# Altium project Smartfin TSoM.PrjPcb
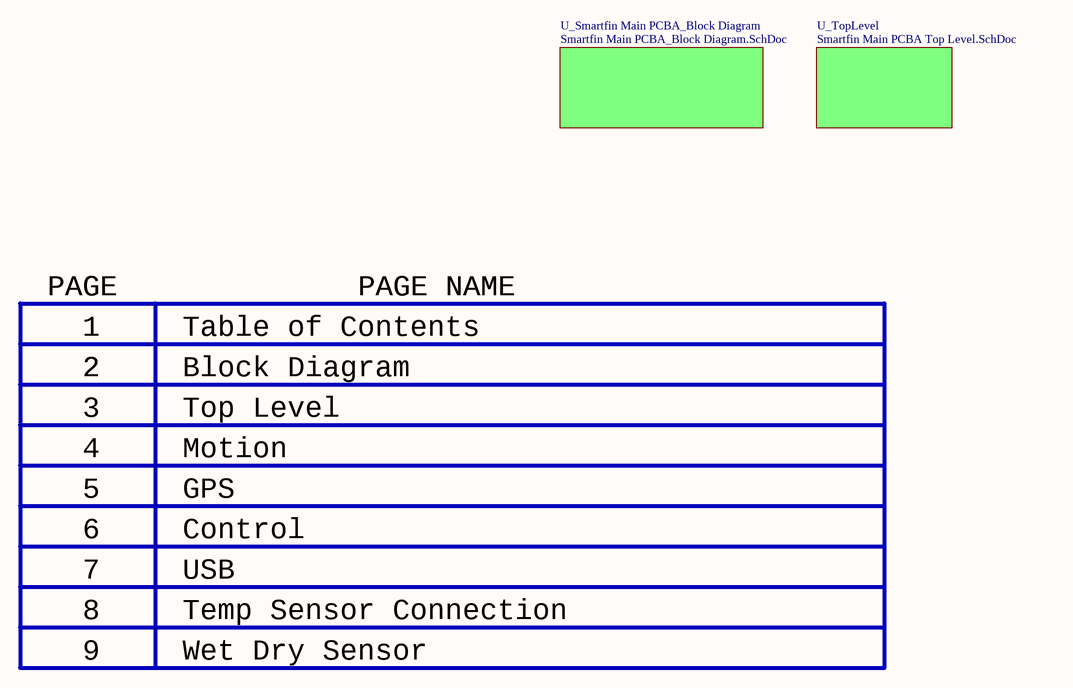
[diagram p0: Smartfin Main PCBA_TOC.SchDoc]
SOLDERMASK_USE_LPI: FALSE; SOLDERMASK_COLOR: BLUE; SCH_DOCNUM: 644-001-023; SCH_CURRENT_REV: C; PROJECT_NUM: 644-001; PROJECT_NAME: Smartfin; OVERLAY_USE_LPI: FALSE; OVERLAY_COLOR: WHITE; FAB_THIEVING_SPACE: 0.100"; FAB_THICKNESS: 0.032; FAB_SURFACE_FINISH: ENIG; FAB_STANDARD_RG_VALUE: 1; FAB_STACKUP_CB_VALUE: 0; FAB_STACKUP: USE FABRICATOR'S STANDARD LAYER STACK; FAB_SOLDER_SLIVERS: 0.004"; FAB_SOLDERMASK_COLOR: BLUE; FAB_ROHS: SHALL BE ROHS COMPLIANT; FAB_OVERLAY_COLOR: WHITE; FAB_MIN_ANNULAR_RING: 0.005"; FAB_MATERIAL_RG_VALUE: 3; FAB_MATERIAL: FR370-HR; FAB_LAYER_REGISTRATION: 0.005"; FAB_LAYERS: 4; FAB_IPC_STD: IPC-6012; FAB_INSPECT_CLASS: 2; FAB_HOLE_LOCATION: 0.008"; FAB_FINISH_RG_VALUE: 0; FAB_FINISHED_CU_WEIGHT: 1.5; FAB_FAB_CLASS: 2; FAB_ECO_REV3: C; FAB_ECO_REV2: B; FAB_ECO_REV1: A; FAB_ECO_NUM_CURRENT: 13237; FAB_ECO_NUM3: 13237; FAB_ECO_NUM2: 13065; FAB_ECO_NUM1: 12932; FAB_ECO_DESC3: UPDATED SS IN GPS AREA. MODIFED INTERNAL GND POURS IN GPS AREA. SEE ECO FOR DETAILS.; FAB_ECO_DESC2: MISCELLANEOUS UPDATES. SEE ECO FOR DETAILS.; FAB_ECO_DESC1: INITIAL RELEASE; FAB_ECO_DATE3: 8/17/2020; FAB_ECO_DATE2: 2/10/2020; FAB_ECO_DATE1: 10/24/2019; FAB_DRILL_TOLERANCE: 0.003"; FAB_DIMENSIONS_RG_VALUE: 0; FAB_DIMENSIONS: INCHES; FAB_CURRENT_REV: C; FAB_ACCEPT_RG_VALUE: 1; FABNOTE_THICKNESS: 0.032; FABNOTE_LAYERS: 4; FABNOTE_CUSTOMSTACK: FALSE; FABNOTE_12: 12. FINISHED PCB SHALL BE ROHS COMPLIANT.; FABNOTE_11: 11. SURFACE FINISH ON ALL EXPOSED COPPER SHALL BE ENIG.; FABNOTE_10: 10. OVERLAY ON BOTH SIDES, COLOR IS WHITE, UL-94V0 MARK REQUIRED.; FABNOTE_9: 9.  SOLDER MASK BOTH SIDES PER IPC-SM-840, COLOR IS BLUE.; FABNOTE_6: 6.  PCB IS 4 LAYERS, THICKNESS IS 0.032", USE FABRICATOR'S STANDARD LAYER STACK.; FABNOTE_5: 5.  PCB MATERIAL IS EPOXY FIBERGLASS FR370-HR.; FABNOTE_2B: INSPECT PER IPC-A-600, CLASS 2.; FABNOTE_2A: 2.  FABRICATE PCB PER IPC-6011 AND IPC-6012A, CLASS 2.; FABNOTE_1: 1.  DIMENSIONS ARE IN INCHES.; FABDWG_DOCNUM: 644-001-024; CONTACT_PHONE: 858-534-9306; CONTACT_NAME: Nathan Hui; CONTACT_EMAIL: e4e@ucsd.edu; BOM_DOCNUM: 644-001-031; BASELINE_ECO_REV3: C; BASELINE_ECO_REV2: B; BASELINE_ECO_REV1: A; BASELINE_ECO_NUM_CURRENT: 13237; BASELINE_ECO_NUM3: 13237; BASELINE_ECO_NUM2: 13065; BASELINE_ECO_NUM1: 12932; BASELINE_ECO_DATE3: 8/17/2020; BASELINE_ECO_DATE2: 2/10/2020; BASELINE_ECO_DATE1: 10/24/2019; BASELINE_DOCNUM: 644-001-033; BASELINE_CURRENT_REV: C; ASY_XYRS_FILE_NAME: 644-001-032 ASY REV C XYRS ECO13237.TXT; ASY_Wash_CB_Value: 0; ASY_WASH: NOT PERMITTED; ASY_RoHS_CB_Value: True; ASY_ROHS: ROHS COMPLIANT LEAD-FREE SOLDER PROCESS REQUIRED; ASY_NAME: Smartfin Main PCBA; ASY_Moisture_Sensitive_CB_Value: 1; ASY_ECO_REV3: C; ASY_ECO_REV2: B; ASY_ECO_REV1: A; ASY_ECO_NUM_CURRENT: 13237; ASY_ECO_NUM3: 13237; ASY_ECO_NUM2: 13065; ASY_ECO_NUM1: 12932; ASY_ECO_DESC3: UPDATED ASSY NOTES. UPDATED SS IN PCB. UPDATED BOM. SEE ECO FOR DETAILS.; ASY_ECO_DESC2: MISCELLANEOUS UPDATES. SEE ECO FOR DETAILS.; ASY_ECO_DESC1: INITIAL RELEASE; ASY_ECO_DATE3: 8/17/2020; ASY_ECO_DATE2: 2/10/2020; ASY_ECO_DATE1: 10/24/2019; ASY_CURRENT_REV: C; ASY_Confirmal_Coat_CB_Value: 0; ASY_CLASS: 2; ASY_BOM_FILE_NAME: 644-001-031 BOM REV C ECO13237.XLSX; ASY_Accept_RB_Value: 1; ASYNOTE_WASH: FALSE; ASYNOTE_ROHS: TRUE; ASYNOTE_MOISTURESENSITIVE: FALSE; ASYNOTE_11: 11. LABEL EACH ASSEMBLY WITH STANDARD IN HOUSE BUILD ID AND BOARD NUMBER.; ASYNOTE_10: 10. FINAL ASSEMBLY SHALL CONFORM TO IPC-A-610 CLASS 2.; ASYNOTE_9: 9.  DO NOT APPLY CONFORMAL COATING.; ASYNOTE_8: 8.  THIS DESIGN DOES INCLUDE MOISTURE SENSITIVE PARTS.; ASYNOTE_7: 7.  AQUEOUS WASH IS NOT PERMITTED.; ASYNOTE_5: 5.  LEAD-FREE SOLDER PROCESS REQUIRED (ROHS).; ASYNOTE_4: 4.  REFER TO "644-001-032 ASY REV C XYRS ECO13237.TXT" IN THIS ARCHIVE; ASYNOTE_2: 2.  REFER TO "644-001-031 BOM REV C ECO13237.XLSX" IN THIS ARCHIVE; ASYNOTE_1: 1.  DIMENSIONS ARE IN INCHES.; ASYDWG_MOISTURE_SENSITIVE: THIS DESIGN DOES NOT INCLUDE MOISTURE SENSITIVE PARTS; ASYDWG_DOCNUM: 644-001-032
8 sheets, 108 parts. Net scope: flat (ports and power ports of the same name join across sheets).
Board file: PCB1.PcbDoc
Sheets:
  Smartfin Main PCBA_TOC.SchDoc
    U_TopLevel = Smartfin Main PCBA Top Level.SchDoc
      U_Control = Smartfin Main PCBA Control.SchDoc
      U_Motion = Smartfin Main PCBA Motion.SchDoc
      U_Temp - Button = Smartfin Main PCBA Temp Sensor Connection.SchDoc
      U_USB = Smartfin Main PCBA USB.SchDoc
      U_Wet Dry Sensor = Smartfin Main PCBA Wet Dry Sensor.SchDoc
    U_Smartfin Main PCBA_Block Diagram = Smartfin Main PCBA_Block Diagram.SchDoc

## Sheet Smartfin Main PCBA_TOC.SchDoc: Table of Contents
size Letter; TOCFontName: Consolas; TOCFontSize: 24; TOCFontColor: 0; TOCFontAttributes: 0; TOCMaxLinesInTable: 25; TOCVerticalOffset: 200; TOCHorizontalOffset: 500; TOCHorizontalSeparation: 800; TOCVerticalSeparation: 30; TOCHorizTableSize: 640; Engineer: JOHN Q. ENGINEER; DocumentNumber: 000-000-000; Revision: A; SheetNumber: 1; SheetTotal: 8; PageSetup: Record=PageOptions|CenterHorizontal=True|CenterVertical=True|PrintScale=0.96|XCorrection=1.00|YCorrection=1.00|PrintKind=0|BorderSize=5000000|LeftOffset=0|BottomOffset=0|Orientation=2|PaperLength=1000|PaperWidth=1000|Scale=100|PaperSource=7|PrintQuality=-4|MediaType=1|DitherType=10|PaperKind=11" x 17"|PrintScaleMode=1

### Sub-sheets
U_Smartfin Main PCBA_Block Diagram = Smartfin Main PCBA_Block Diagram.SchDoc: no entries
U_TopLevel = Smartfin Main PCBA Top Level.SchDoc: no entries

### Notes on the sheet
- PAGE
- 1
- Table of Contents
- PAGE NAME
- 2
- Block Diagram
- 3
- 4
- Top Level
- Motion
- 5
- 6
- GPS
- Control
- 7
- USB
- 8
- 9
- Temp Sensor Connection
- Wet Dry Sensor

## Sheet Smartfin Main PCBA Top Level.SchDoc: Top Level
size Letter; TOCFontName: Consolas; TOCFontSize: 24; TOCFontColor: 0; TOCFontAttributes: 0; TOCMaxLinesInTable: 25; TOCVerticalOffset: 200; TOCHorizontalOffset: 500; TOCHorizontalSeparation: 800; TOCVerticalSeparation: 30; TOCHorizTableSize: 640; Engineer: Amy Domino; DocumentNumber: 644-001-023; Revision: A; SheetNumber: 3; SheetTotal: 9; PageSetup: Record=PageOptions|CenterHorizontal=True|CenterVertical=True|PrintScale=0.96|XCorrection=1.00|YCorrection=1.00|PrintKind=0|BorderSize=5000000|LeftOffset=0|BottomOffset=0|Orientation=2|PaperLength=1000|PaperWidth=1000|Scale=100|PaperSource=7|PrintQuality=-4|MediaType=1|DitherType=10|PaperKind=11" x 17"|PrintScaleMode=1
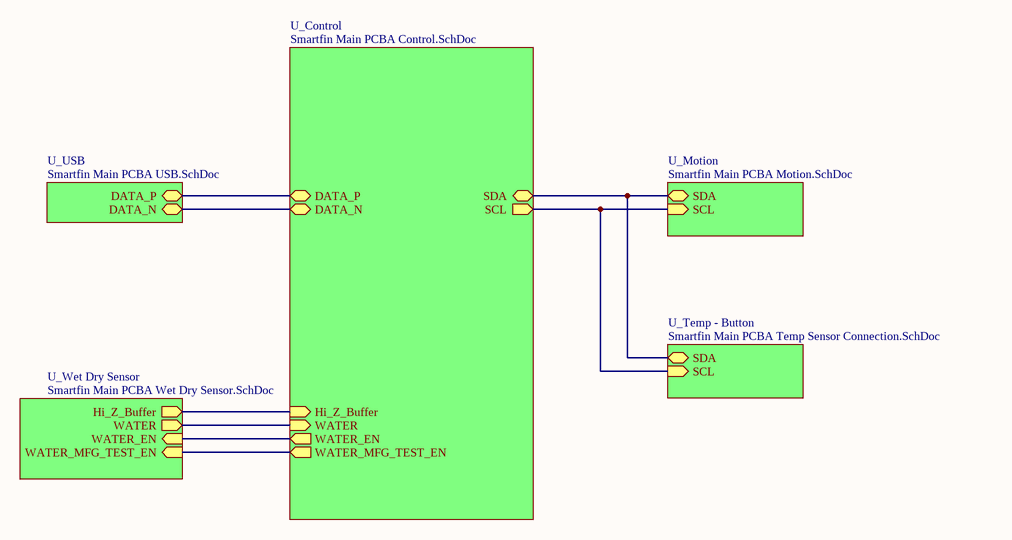
[diagram p1: Smartfin Main PCBA Top Level.SchDoc]

### Sub-sheets
U_Control = Smartfin Main PCBA Control.SchDoc: WATER (in), DATA_N (bidir), DATA_P (bidir), SDA (bidir), SCL (out), WATER_EN (out), Hi_Z_Buffer (in), WATER_MFG_TEST_EN (out)
U_Motion = Smartfin Main PCBA Motion.SchDoc: SDA (bidir), SCL (in)
U_Temp - Button = Smartfin Main PCBA Temp Sensor Connection.SchDoc: SDA (bidir), SCL (in)
U_USB = Smartfin Main PCBA USB.SchDoc: DATA_N (bidir), DATA_P (bidir)
U_Wet Dry Sensor = Smartfin Main PCBA Wet Dry Sensor.SchDoc: WATER (out), WATER_EN (in), Hi_Z_Buffer (out), WATER_MFG_TEST_EN (in)

### Nets
(unnamed): sheet U_Control/WATER, sheet U_Wet Dry Sensor/WATER
(unnamed): sheet U_Control/DATA_N, sheet U_USB/DATA_N
(unnamed): sheet U_Control/DATA_P, sheet U_USB/DATA_P
(unnamed): sheet U_Control/SDA, sheet U_Motion/SDA, sheet U_Temp - Button/SDA
(unnamed): sheet U_Control/SCL, sheet U_Motion/SCL, sheet U_Temp - Button/SCL
(unnamed): sheet U_Control/WATER_EN, sheet U_Wet Dry Sensor/WATER_EN
(unnamed): sheet U_Control/Hi_Z_Buffer, sheet U_Wet Dry Sensor/Hi_Z_Buffer
(unnamed): sheet U_Control/WATER_MFG_TEST_EN, sheet U_Wet Dry Sensor/WATER_MFG_TEST_EN

## Sheet Smartfin Main PCBA Control.SchDoc: Control
size Letter; TOCFontName: Consolas; TOCFontSize: 24; TOCFontColor: 0; TOCFontAttributes: 0; TOCMaxLinesInTable: 25; TOCVerticalOffset: 200; TOCHorizontalOffset: 500; TOCHorizontalSeparation: 800; TOCVerticalSeparation: 30; TOCHorizTableSize: 640; Engineer: Amy Domino; DocumentNumber: 644-001-023; Revision: A; SheetNumber: 3; SheetTotal: 8; PageSetup: Record=PageOptions|CenterHorizontal=True|CenterVertical=True|PrintScale=0.96|XCorrection=1.00|YCorrection=1.00|PrintKind=0|BorderSize=5000000|LeftOffset=0|BottomOffset=0|Orientation=2|PaperLength=1000|PaperWidth=1000|Scale=100|PaperSource=7|PrintQuality=-4|MediaType=1|DitherType=10|PaperKind=11" x 17"|PrintScaleMode=1
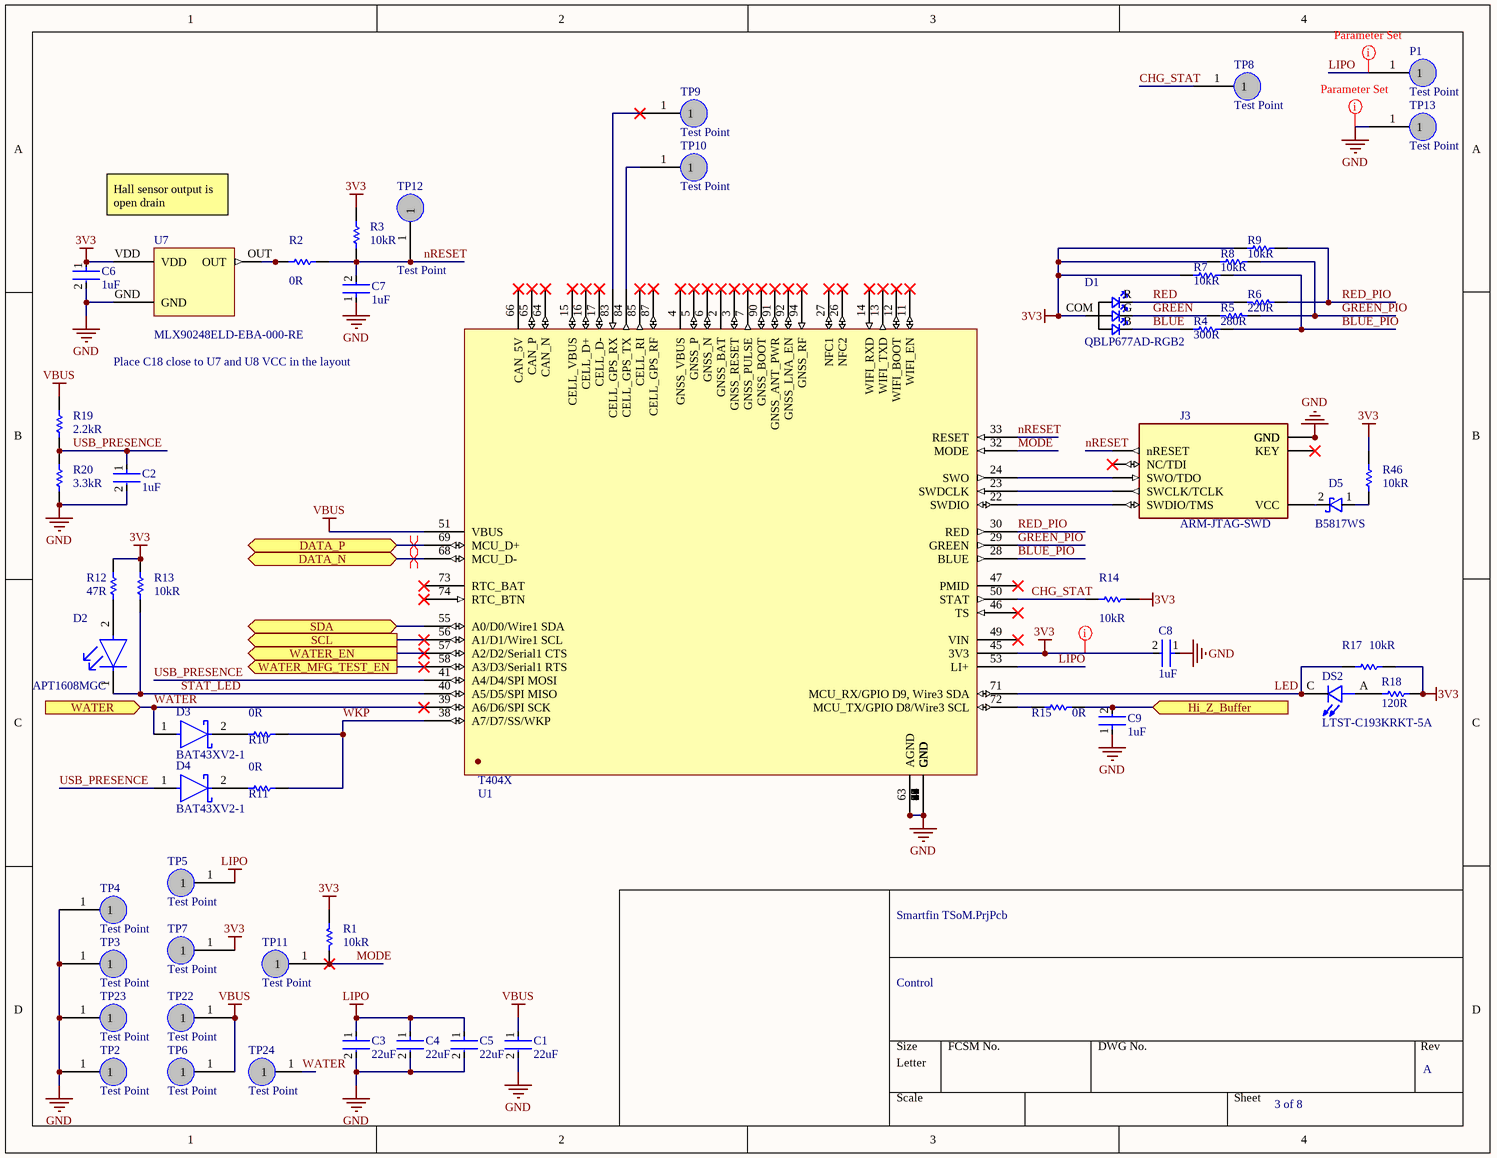
[diagram p2: Smartfin Main PCBA Control.SchDoc]

### Parts
C1  value 22uF  [FP-CC0603-DC-IPC_B]  (hidden comment: CC0603MRX5R5BB226)
C2  value 1uF  [FP-CC0402-IPC_C]  (hidden comment: cc0402krx5r6bb105)
C3  value 22uF  [FP-CC0603-DC-IPC_B]  (hidden comment: CC0603MRX5R5BB226)
C4  value 22uF  [FP-CC0603-DC-IPC_B]  (hidden comment: CC0603MRX5R5BB226)
C5  value 22uF  [FP-CC0603-DC-IPC_B]  (hidden comment: CC0603MRX5R5BB226)
C6  value 1uF  [FP-CC0402-IPC_C]  (hidden comment: cc0402krx5r6bb105)
C7  value 1uF  [FP-CC0402-IPC_C]  (hidden comment: cc0402krx5r6bb105)
C8  value 1uF  [FP-CC0402-IPC_C]  (hidden comment: cc0402krx5r6bb105)
C9  value 1uF  [FP-CC0402-IPC_C]  (hidden comment: cc0402krx5r6bb105)
D1  QBLP677AD-RGB2  [New footprint 1]
D2  APT1608MGC  [SODFL160X75-2N]
D3  BAT43XV2-1  [SODFL250X75-2N]
D4  BAT43XV2-1  [SODFL250X75-2N]
D5  B5817WS  [SODFL250X135-2N]
DS2  LTST-C193KRKT-5A  [LEDC1608X45N]
J3  ARM-JTAG-SWD  [ARM-JTAG-10-SWD-IDC]
P1  Test Point  [New footprint 1]
R1  value 10kR  [RESC1005X04N]  (hidden comment: RC0402FR-0710KL)
R2  value 0R  [RESC1005X04N]  (hidden comment: RC0402JR-070RL)
R3  value 10kR  [RESC1005X04N]  (hidden comment: RC0402FR-0710KL)
R4  value 300R  [RESC1005X04N]  (hidden comment: RC0402FR-07300RL)
R5  value 280R  [RESC1005X04N]  (hidden comment: RC0402FR-07280RL)
R6  value 220R  [RESC1005X04N]  (hidden comment: RC0402FR-07220R)
R7  value 10kR  [RESC1005X04N]  (hidden comment: RC0402FR-0710KL)
R8  value 10kR  [RESC1005X04N]  (hidden comment: RC0402FR-0710KL)
R9  value 10kR  [RESC1005X04N]  (hidden comment: RC0402FR-0710KL)
R10  value 0R  [RESC1005X04N]  (hidden comment: RC0402JR-070RL)
R11  value 0R  [RESC1005X04N]  (hidden comment: RC0402JR-070RL)
R12  47R  [RESC1005X40X25LL05T10]
R13  value 10kR  [RESC1005X04N]  (hidden comment: RC0402FR-0710KL)
R14  value 10kR  [RESC1005X04N]  (hidden comment: RC0402FR-0710KL)
R15  value 0R  [RESC1005X04N]  (hidden comment: RC0402JR-070RL)
R17  value 10kR  [RESC1005X04N]  (hidden comment: RC0402FR-0710KL)
R18  value 120R  [RESC1005X04N]  (hidden comment: RC0402FR-07120RL)
R19  value 2.2kR  [RESC1005X04N]  (hidden comment: RC0402FR-072K2L)
R20  value 3.3kR  [RESC1005X04N]  (hidden comment: RC0402FR-073K3L)
R46  value 10kR  [RESC1005X04N]  (hidden comment: RC0402FR-0710KL)
TP2  Test Point  [New footprint 1]
TP3  Test Point  [New footprint 1]
TP4  Test Point  [New footprint 1]
TP5  Test Point  [New footprint 1]
TP6  Test Point  [New footprint 1]
TP7  Test Point  [New footprint 1]
TP8  Test Point  [New footprint 1]
TP9  Test Point  [New footprint 1]
TP10  Test Point  [New footprint 1]
TP11  Test Point  [New footprint 1]
TP12  Test Point  [New footprint 1]
TP13  Test Point  [New footprint 1]
TP22  Test Point  [New footprint 1]
TP23  Test Point  [New footprint 1]
TP24  Test Point  [New footprint 1]
U1  T404X  [New footprint 1]
U7  MLX90248ELD-EBA-000-RE  [SON50P150X40_HS-7N]

### Ports
DATA_N (bidir), DATA_P (bidir), Hi_Z_Buffer (in), SCL (out), SDA (bidir), WATER (in), WATER_EN (out), WATER_MFG_TEST_EN (out)

### Nets
3V3: C6.1 C8.2 D1.COM R1.2 R3.2 R7.2 R8.2 R9.2 R12.2 R13.2 R14.2 R17.2 R18.2 R46.1 TP7.1 U1.45(3V3) U7.VDD
GND: C1.2 C2.2 C3.2 C4.2 C5.2 C6.2 C7.1 C8.1 C9.1 J3.GND@1(GND) J3.GND@2(GND) J3.GND@3(GND) R20.1 TP2.1 TP3.1 TP4.1 TP13.1 TP23.1 U1.1(GND) U1.8(GND) U1.10(GND) U1.25(GND) U1.31(GND) U1.42(GND) U1.43(GND) U1.48(GND) U1.52(GND) U1.54(GND) U1.63(AGND) U1.67(GND) U1.70(GND) U1.75(GND) U1.86(GND) U1.88(GND) U1.89(GND) U1.93(GND) U1.95(GND) U7.GND
LIPO: C3.1 C4.1 C5.1 P1.1 TP5.1 U1.53(LI+)
VBUS: C1.1 R19.1 TP6.1 TP22.1 U1.51(VBUS)
BLUE: D1.B R4.2
BLUE_PIO: R4.1 R7.1 U1.28(BLUE)
CHG_STAT: R14.1 TP8.1 U1.50(STAT)
DATA_N: U1.68(MCU_D-) ; port DATA_N
DATA_P: U1.69(MCU_D+) ; port DATA_P
GREEN: D1.G R5.2
GREEN_PIO: R5.1 R8.1 U1.29(GREEN)
Hi_Z_Buffer: C9.2 R15.2 ; port Hi_Z_Buffer
LED: DS2.C R17.1 U1.71(MCU_RX/GPIO_D9,_Wire3_SDA)
MODE: R1.1 TP11.1 U1.32(MODE)
nRESET: C7.2 J3.nRESET R2.2 R3.1 TP12.1 U1.33(RESET)
RED: D1.R R6.2
RED_PIO: R6.1 R9.1 U1.30(RED)
SCL: U1.56(A1/D1/Wire1_SCL) ; port SCL
SDA: U1.55(A0/D0/Wire1_SDA) ; port SDA
STAT_LED: D2.1(C) R13.1 U1.40(A5/D5/SPI_MISO)
USB_PRESENCE: C2.1 D4.1(C) R19.2 R20.2 U1.41(A4/D4/SPI_MOSI)
WATER: D3.1(C) TP24.1 U1.39(A6/D6/SPI_SCK) ; port WATER
WATER_EN: U1.57(A2/D2/Serial1_CTS) ; port WATER_EN
WATER_MFG_TEST_EN: U1.58(A3/D3/Serial1_RTS) ; port WATER_MFG_TEST_EN
WKP: R10.2 R11.2 U1.38(A7/D7/SS/WKP)
NetD2_2: D2.2(A) R12.1
NetD3_2: D3.2(A) R10.1
NetD4_2: D4.2(A) R11.1
NetD5_1: D5.1 R46.2
NetD5_2: D5.2 J3.VCC
NetDS2_A: DS2.A R18.1
NetJ3_TCK: J3.TCK(SWCLK/TCLK) U1.23(SWDCLK)
NetJ3_TDO: J3.TDO(SWO/TDO) U1.24(SWO)
NetJ3_TMS: J3.TMS(SWDIO/TMS) U1.22(SWDIO)
NetR2_1: R2.1 U7.OUT
NetR15_1: R15.1 U1.72(MCU_TX/GPIO_D8/Wire3_SCL)
NetTP9_1: TP9.1 U1.83(CELL_GPS_RX)
NetTP10_1: TP10.1 U1.84(CELL_GPS_TX)
NetU1_9: U1.9(NC) U1.18(NC) U1.19(NC) U1.20(NC) U1.21(NC) U1.34(NC) U1.35(NC) U1.36(NC) U1.37(NC) U1.44(NC) U1.59(NC) U1.60(NC) U1.61(NC) U1.62(NC) U1.76(NC) U1.77(NC) U1.78(NC) U1.79(NC) U1.80(NC) U1.81(NC) U1.82(NC)

Not connected (* = marked no-connect by the designer): J3 KEY* TDI(NC/TDI)*; U1 2(GNSS_BAT)* 3(GNSS_RESET)* 4(GNSS_VBUS)* 5(GNSS_P)* 6(GNSS_N)* 7(GNSS_PULSE)* 11(WIFI_EN)* 12(WIFI_BOOT)* 13(WIFI_TXD)* 14(WIFI_RXD)* 15(CELL_VBUS)* 16(CELL_D+)* 17(CELL_D-)* 26(NFC2)* 27(NFC1)* 46(TS)* 47(PMID)* 49(VIN)* 64(CAN_N)* 65(CAN_P)* 66(CAN_5V)* 73(RTC_BAT)* 74(RTC_BTN)* 85(CELL_RI)* 87(CELL_GPS_RF)* 90(GNSS_BOOT)* 91(GNSS_ANT_PWR)* 92(GNSS_LNA_EN)* 94(GNSS_RF)*

### Layout directives
differential pair; rule Signal Stimulus [Kind - Single Pulse    Level - High    Start Time = 0.000    Stop Time = 2.083n    Period Time = 4.167n]: DATA_N, DATA_P
rule Supply Nets [Voltage = 3.700]; net class POWER: LIPO
net class POWER: GND
rule Supply Nets [Voltage = 3.300]; net class POWER: 3V3

### Notes on the sheet
- Hall sensor output is open drain
- Place C18 close to U7 and U8 VCC in the layout

### Library data of the parts
C1 C3-C5 = YAGEO-CC0603MRX5R5BB226-1: Ceramic Capacitor, Multilayer, Ceramic, 6.3V, 20% +Tol, 20% -Tol, X5R, 15% TC, 22uF, Surface Mount, 0603
C2 C6-C9 = YAGEO-CC0402KRX5R6BB105-1: Ceramic Capacitor, Multilayer, Ceramic, 10V, 10% +Tol, 10% -Tol, X5R, 15% TC, 1uF, Surface Mount, 0402
D1 = CMP-006-000001-13: Led Rgb, 3528 PLCC4 Dome Lens, 2; ComponentLink1Description: https://www.digikey.com/en/products/detail/qt-brightek-qtb/QBLP677AD-RGB2/10401015
D2 = CMP-006-000000-5: Single Color LED, Mega Green, Water Clear, 1.2mm
D3 D4 = CMP-004-123445-3: Rectifier Diode, Schottky, 1 Phase, 1 Element, 0.2A, 30V V(RRM), Silicon; Non-rep Pk Forward Current-Max: 4A; Max Power Dissipation: 200mW; Reverse Recovery Time-Max: 0.005us; Forward Voltage: 330mV; Package Body Material: Plastic; Qualification Status: Not Qualified; Number of Elements: 1; Max Output current: 200mA; Reach SVHC Compliant: Yes; JESD-30 Code: R-PDSO-F2; Package Shape: Rectangular; Pins: 2; Technology: SCHOTTKY; Package Style: SMALL OUTLINEMeter; Diode Element Material: SILICON; Terminal Form: Flat; RoHS Compliant: Yes; Moisture Sensitivity Level: 1; Rep Pk Reverse Voltage-Max: 30V; Diode Type: RECTIFIER; Terminal Position: DUAL; Max Operating Temperature: 125°C; Surface Mount: Yes
D5 = CMP-004-000013-6: Rectifier Diode Schottky 20V 1A 2-Pin SOD-323 T/R
DS2 = CMP-004-000003-1: Red 631nm LED Indication - Discrete 2V 0603 (1608 Metric); MF: Lite-On Inc.; Pin Count: 2; SnapEDA_Link: https://www.snapeda.com/parts/LTST-C193KRKT-5A/Lite-On+Inc./view-part/?ref=snap; Value: *; Source: LTST-C193KRKT-5A.SchLib; Package: 0603 Lite-On Inc.; Design Item ID: LTST-C193KRKT-5A; Purchase-URL: https://pricing.snapeda.com/search/part/LTST-C193KRKT-5A/?ref=eda; MP: LTST-C193KRKT-5A; Component Type: Standard; Check_prices: https://www.snapeda.com/parts/LTST-C193KRKT-5A/Lite-On+Inc./view-part/?ref=eda; Digi-Key_Part_Number: 160-1830-2-ND
J3 = CMP-046-000000-2: DEBUG ADAPTER FOR ARM-USB-TINY-H; MF: Olimex LTD; Price: None; Purchase-URL: https://pricing.snapeda.com/search/part/ARM-JTAG-SWD/?ref=eda; Design Item ID: ARM-JTAG-SWD; Availability: In Stock; Component Type: Standard; SnapEDA_Link: https://www.snapeda.com/parts/ARM-JTAG-SWD/Olimex+LTD/view-part/?ref=snap; MP: ARM-JTAG-SWD; Check_prices: https://www.snapeda.com/parts/ARM-JTAG-SWD/Olimex+LTD/view-part/?ref=eda; Package: None; Source: ARM-JTAG-SWD.SchLib; Pin Count: 10; Value: *
P1 TP2-TP13 TP22-TP24 = CMP-00002-11
R1 R3 R7-R9 R13 R14 R17 R46 = CMP-002-000053-2: Fixed Resistor, Metal Glaze/thick Film, 0.0625W, 10000ohm, 50V, 1% +/-Tol, 100ppm/Cel, Surface Mount, 0402
R2 R10 R11 R15 = YAGEO-RC0402JR-070RL-1: Metal Glaze/thick Film, 0.0625W, 0ohm, Surface Mount, 0402
R4 = YAGEO-RC0402FR-07300RL-2: Fixed Resistor, Metal Glaze/thick Film, 0.0625W, 300ohm, 50V, 1% +/-Tol, 100ppm/Cel, Surface Mount, 0402
R5 = YAGEO-RC0402FR-07280RL-2: Fixed Resistor, Metal Glaze/thick Film, 0.0625W, 280ohm, 50V, 1% +/-Tol, 100ppm/Cel, Surface Mount, 0402
R6 = YAGEO-RC0402FR-07220R-2: Fixed Resistor, Metal Glaze/thick Film, 0.0625W, 220ohm, 50V, 1% +/-Tol, 100ppm/Cel, Surface Mount, 0402
R12 = CMP-2002-07703-1: Manufacturer: Yageo / Phycomp; Part Number: RC0402FR-0747RL
R18 = CMP-002-000051-2: Fixed Resistor, Metal Glaze/thick Film, 0.0625W, 120ohm, 50V, 1% +/-Tol, 100ppm/Cel, Surface Mount, 0402
R19 = YAGEO-RC0402FR-072K2L-3: Fixed Resistor, Metal Glaze/thick Film, 0.0625W, 2200ohm, 50V, 1% +/-Tol, 100ppm/Cel, Surface Mount, 0402; Temperature Coefficient: 100ppm/°C; Rated Temperature: 70°C; Package Length: 1mm; Package Height: 0.35mm; Package Width: 0.5mm; Power: 62.5mW; Additional Feature: LASER TRIMMABLE; Termination: Wraparound; Construction: Chip; Min Operating Temperature: -55°C; Max Operating Temperature: 155°C; RoHS Compliant: Yes; Working Voltage: 50V; Terminal Finish: Nickel; JESD-609 Code: e3; Package Shape: Rectangular; Package Style: SMTMeter; Reach SVHC Compliant: Yes; Technology: METAL GLAZE/THICK FILM; Resistor Type: FIXED RESISTOR; Pins: 2; Case/Package: 0402; Packaging: Tape and Reel; Tolerance: 1%; Mounting Technology: Surface Mount
R20 = YAGEO-RC0402FR-073K3L-3: Fixed Resistor, Metal Glaze/thick Film, 0.0625W, 3300ohm, 50V, 1% +/-Tol, 100ppm/Cel, Surface Mount, 0402; Package Height: 0.35mm; Package Width: 0.5mm; Rated Temperature: 70°C; Temperature Coefficient: 100ppm/°C; Additional Feature: LASER TRIMMABLE; Power: 62.5mW; Package Length: 1mm; Package Style: SMTMeter; Terminal Finish: Nickel; Construction: Chip; Min Operating Temperature: -55°C; Case/Package: 0402; Resistor Type: FIXED RESISTOR; Max Operating Temperature: 155°C; Reach SVHC Compliant: Yes; Mounting Technology: Surface Mount; RoHS Compliant: Yes; Technology: METAL GLAZE/THICK FILM; Working Voltage: 50V; Termination: Wraparound; Package Shape: Rectangular; Tolerance: 1%; Pins: 2; JESD-609 Code: e3; Packaging: Tape and Reel
U1 = CMP-002-000045-13: Tracker System on a Module; ComponentLink1URL: https://docs.particle.io/reference/datasheets/tracker/tracker-som-datasheet/
U7 = CMP-002-000033-5: Micropower & Omnipolar Hall Switch; Pin Count: 6; Component Type: Switch; Package: UTQFN-6L

## Sheet Smartfin Main PCBA Motion.SchDoc
size Letter; TOCFontName: Consolas; TOCFontSize: 24; TOCFontColor: 0; TOCFontAttributes: 0; TOCMaxLinesInTable: 25; TOCVerticalOffset: 200; TOCHorizontalOffset: 500; TOCHorizontalSeparation: 800; TOCVerticalSeparation: 30; TOCHorizTableSize: 640; PageSetup: Record=PageOptions|CenterHorizontal=True|CenterVertical=True|PrintScale=0.96|XCorrection=1.00|YCorrection=1.00|PrintKind=0|BorderSize=5000000|LeftOffset=0|BottomOffset=0|Orientation=2|PaperLength=1000|PaperWidth=1000|Scale=100|PaperSource=7|PrintQuality=-4|MediaType=1|DitherType=10|PaperKind=11" x 17"|PrintScaleMode=1; SheetNumber: 4; SheetTotal: 8
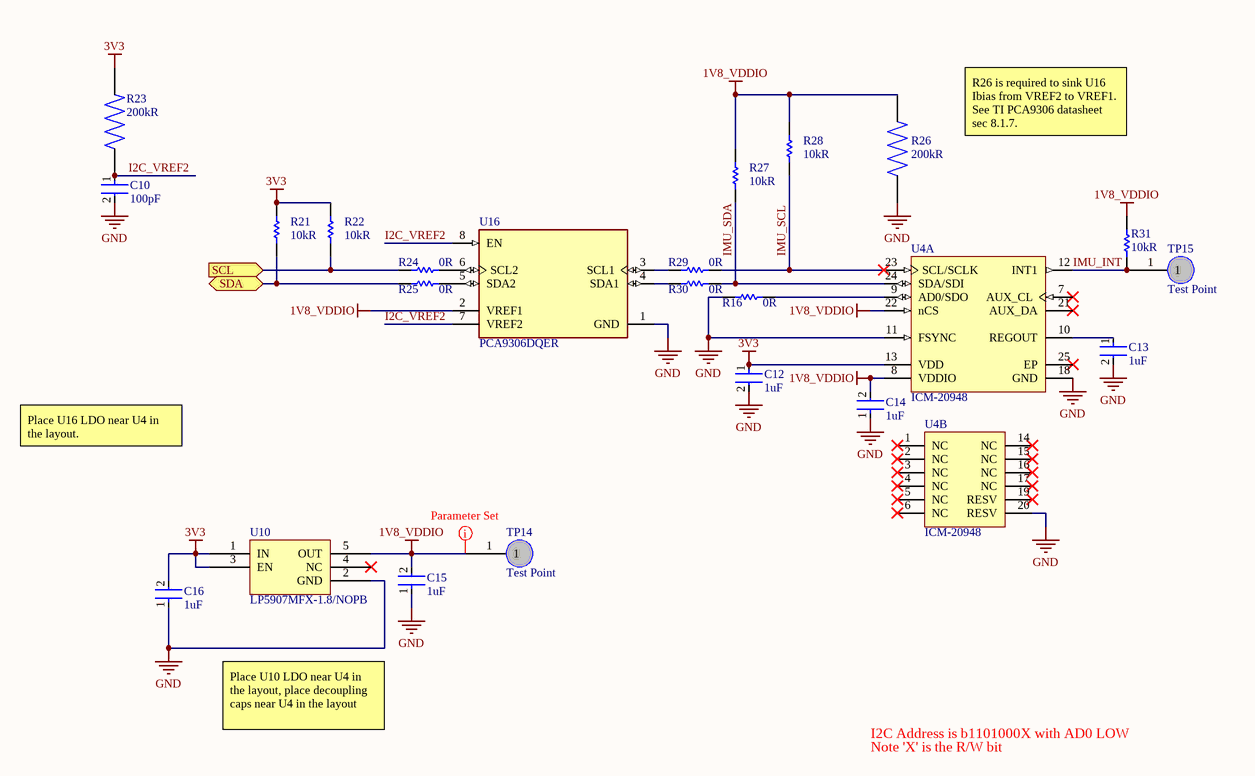
[diagram p3: Smartfin Main PCBA Motion.SchDoc]

### Parts
C10  value 100pF  [CAPC1005X06N]  (hidden comment: CC0402KRX7R9BB101)
C12  value 1uF  [FP-CC0402-IPC_C]  (hidden comment: cc0402krx5r6bb105)
C13  value 1uF  [FP-CC0402-IPC_C]  (hidden comment: cc0402krx5r6bb105)
C14  value 1uF  [FP-CC0402-IPC_C]  (hidden comment: cc0402krx5r6bb105)
C15  value 1uF  [FP-CC0402-IPC_C]  (hidden comment: cc0402krx5r6bb105)
C16  value 1uF  [FP-CC0402-IPC_C]  (hidden comment: cc0402krx5r6bb105)
R16  value 0R  [RESC1005X04N]  (hidden comment: RC0402JR-070RL)
R21  value 10kR  [RESC1005X04N]  (hidden comment: RC0402FR-0710KL)
R22  value 10kR  [RESC1005X04N]  (hidden comment: RC0402FR-0710KL)
R23  value 200kR  [RESC1005X04N]  (hidden comment: RC0402JR-07200KL)
R24  value 0R  [RESC1005X04N]  (hidden comment: RC0402JR-070RL)
R25  value 0R  [RESC1005X04N]  (hidden comment: RC0402JR-070RL)
R26  value 200kR  [RESC1005X04N]  (hidden comment: RC0402JR-07200KL)
R27  value 10kR  [RESC1005X04N]  (hidden comment: RC0402FR-0710KL)
R28  value 10kR  [RESC1005X04N]  (hidden comment: RC0402FR-0710KL)
R29  value 0R  [RESC1005X04N]  (hidden comment: RC0402JR-070RL)
R30  value 0R  [RESC1005X04N]  (hidden comment: RC0402JR-070RL)
R31  value 10kR  [RESC1005X04N]  (hidden comment: RC0402FR-0710KL)
TP14  Test Point  [New footprint 1]
TP15  Test Point  [New footprint 1]
U4  ICM-20948  [TDK-QFN-24_L]  (parts A,B of 2)
U10  LP5907MFX-1.8/NOPB  [SOT95P280X145-5N]
U16  PCA9306DQER  [FP-DQE0008A-MFG]

### Ports
SCL (in), SDA (bidir)

### Nets
1V8_VDDIO: C14.2 C15.2 R26.2 R27.2 R28.2 R31.2 TP14.1 U4.8(VDDIO) U4.22(nCS) U10.5(OUT) U16.2(VREF1)
3V3: C12.1 C16.2 R21.2 R22.2 R23.2 U4.13(VDD) U10.1(IN) U10.3(EN)
GND: C10.2 C12.2 C13.2 C14.1 C15.1 C16.1 R16.1 R26.1 U4.11(FSYNC) U4.18(GND) U4.20(RESV) U10.2(GND) U16.1(GND)
I2C_VREF2: C10.1 R23.1 U16.7(VREF2) U16.8(EN)
IMU_INT: R31.1 TP15.1 U4.12(INT1)
IMU_SCL: R28.1 R29.2 U4.23(SCL/SCLK)
IMU_SDA: R27.1 R30.2 U4.24(SDA/SDI)
SCL: R22.1 R24.1 ; port SCL
SDA: R21.1 R25.1 ; port SDA
NetC13_1: C13.1 U4.10(REGOUT)
NetR16_2: R16.2 U4.9(AD0/SDO)
NetR24_2: R24.2 U16.6(SCL2)
NetR25_2: R25.2 U16.5(SDA2)
NetR29_1: R29.1 U16.3(SCL1)
NetR30_1: R30.1 U16.4(SDA1)

Not connected (* = marked no-connect by the designer): U4 1(NC)* 2(NC)* 3(NC)* 4(NC)* 5(NC)* 6(NC)* 7(AUX_CL)* 14(NC)* 15(NC)* 16(NC)* 17(NC)* 19(RESV)* 21(AUX_DA)* 25(EP)*; U10 4(NC)*

### Layout directives
rule Supply Nets [Voltage = 1.800]; net class POWER: 1V8_VDDIO

### Notes on the sheet
- R26 is required to sink U16 Ibias from VREF2 to VREF1. See TI PCA9306 datasheet sec 8.1.7.
- Place U16 LDO near U4 in the layout.
- Place U10 LDO near U4 in the layout, place decoupling caps near U4 in the layout
- I2C Address is b1101000X with AD0 LOW
- Note 'X' is the R/W bit

### Library data of the parts
C10 = YAGEO-CC0402KRX7R9BB101-3: Ceramic Capacitor, Multilayer, Ceramic, 50V, 10% +Tol, 10% -Tol, X7R, 15% TC, 0.0001uF, Surface Mount, 0402
C12-C16 = YAGEO-CC0402KRX5R6BB105-1: as C2 on sheet Smartfin Main PCBA Control
R16 R24 R25 R29 R30 = YAGEO-RC0402JR-070RL-1: as R2 on sheet Smartfin Main PCBA Control
R21 R22 R27 R28 R31 = CMP-002-000053-2: as R1 on sheet Smartfin Main PCBA Control
R23 R26 = CMP-002-000016-2: Res Thick Film 0402 200K Ohm 5% 0.063W(1/16W) ?100ppm/C Molded SMD Paper T/R; MF: {'manufacturer': u'YAGEO'}; Component Type: Standard; Source: RC0402JR-07200KL.SchLib; MP: RC0402JR-07200KL; Pin Count: 2; Price: None; Availability: Unavailable; Package: None; Design Item ID: RC0402JR-07200KL
TP14 TP15 = CMP-00002-11
U4 = CMP-002-000006-5: 9-Axis MEMS MotionTracking Device Gyroscope/Accelerometer/Compass Digital Motion Processor 24-Pin QFN; Pin Count: 24; Component Type: Standard; Source: ICM-20948.SchLib; MP: ICM-20948; Package: None; Design Item ID: ICM-20948; Availability: Unavailable; Value: *; Price: None
U10 = CMP-002-000011-4: 250-mA, low-noise, high-PSRR, low-IQ, ultra-low-dropout voltage regulator with low-IQ and enable 5-SOT-23 -40 to 125; Qualification Status: Not Qualified; Adjustability: FIXED; Number of Outputs: 1; Output Voltage1-Min: 1.764V; Regulator Type: FIXED POSITIVE SINGLE OUTPUT LDO REGULATOR; Output Voltage1-Nom: 1.8V; Min Input Voltage: 2.2V; Output Voltage1-Max: 1.836V; Package Body Material: Plastic; Package Equivalence Code: TSOP5/6,.11,37; Dropout Voltage1-Max: 250mV; Output Current1-Max: 250mA; Max Supply Voltage: 5.5V; Voltage Tolerance-Max: 2%; Input Voltage Absolute-Max: 6V; Price: None; Design Item ID: LP5907MFX-1.8/NOPB; Component Type: Standard; Value: *; Pin Count: 5; Source: LP5907MFX-1.8_NOPB.SchLib; Availability: Unavailable; MP: LP5907MFX-1.8/NOPB; Package: None; Terminal Finish: Tin; Moisture Sensitivity Level: 1; Height - Seated (Max): 1.45mm; Packaging: Tape and Reel; Width: 1.6mm; Package Shape: Rectangular; Pins: 5; Terminal Pitch: 0.95mm; Operating Temperature, TJ-Min: -40°C; Case/Package: LSSOP; Terminal Form: Gull Wing; RoHS Compliant: Yes; JESD-609 Code: e3; Package Style: SMALL OUTLINE, LOW PROFILE, SHRINK PITCHMeter; JESD-30 Code: R-PDSO-G5; Channels: 1; Length: 2.9mm; Reach SVHC Compliant: Yes; Technology: CMOS; Peak Reflow Temperature (Cel): 260°C; Operating Temperature, TJ-Max: 125°C; Terminal Position: DUAL; Surface Mount: Yes
U16 = CMP-010-000000-10: 2-bit bidirectional I2C bus and SMBus voltage-level shifter 8-X2SON -40 to 85; MF: Texas Instruments; Channels: 2; Qualification Status: Not Qualified; Max Supply Voltage: 5V; Min Supply Voltage: 0V; Package Body Material: Plastic; Interface IC Type: INTERFACE CIRCUIT; Value: *; MP: PCA9306DQER; Design Item ID: PCA9306DQER; Pin Count: 8; SnapEDA_Link: https://www.snapeda.com/parts/PCA9306DQER/Texas%20Instruments/view-part/39064/?ref=snap; Package: X2SON-8 Texas Instruments; Mouser-Purchase-URL: https://snapeda.com/shop?store=Mouser&id=39064; Source: PCA9306DQER.SchLib; Texas_Instruments-Purchase-URL: https://snapeda.com/shop?store=Texas+Instruments&id=39064; Availability: Warning; Component Type: Standard; Price: None; Length: 1.4mm; Surface Mount: Yes; Pins: 8; Width: 1mm; JESD-30 Code: R-PDSO-N8; Package Style: SMALL OUTLINE, VERY THIN PROFILEMeter; Temperature Grade: INDUSTRIAL; Min Operating Temperature: -40°C; Moisture Sensitivity Level: 1; Max Operating Temperature: 85°C; Terminal Position: DUAL; Terminal Pitch: 0.35mm; RoHS Compliant: Yes; Terminal Form: No Lead; Terminal Finish: Nickel; Package Shape: Rectangular; Case/Package: VSON; Peak Reflow Temperature (Cel): 260°C; Reach SVHC Compliant: Yes; JESD-609 Code: e4; Height - Seated (Max): 0.4mm

## Sheet Smartfin Main PCBA Temp Sensor Connection.SchDoc
size Letter; TOCFontName: Consolas; TOCFontSize: 24; TOCFontColor: 0; TOCFontAttributes: 0; TOCMaxLinesInTable: 25; TOCVerticalOffset: 200; TOCHorizontalOffset: 500; TOCHorizontalSeparation: 800; TOCVerticalSeparation: 30; TOCHorizTableSize: 640; PageSetup: Record=PageOptions|CenterHorizontal=True|CenterVertical=True|PrintScale=0.96|XCorrection=1.00|YCorrection=1.00|PrintKind=0|BorderSize=5000000|LeftOffset=0|BottomOffset=0|Orientation=2|PaperLength=1000|PaperWidth=1000|Scale=100|PaperSource=7|PrintQuality=-4|MediaType=1|DitherType=10|PaperKind=11" x 17"|PrintScaleMode=1; SheetNumber: 5; SheetTotal: 8
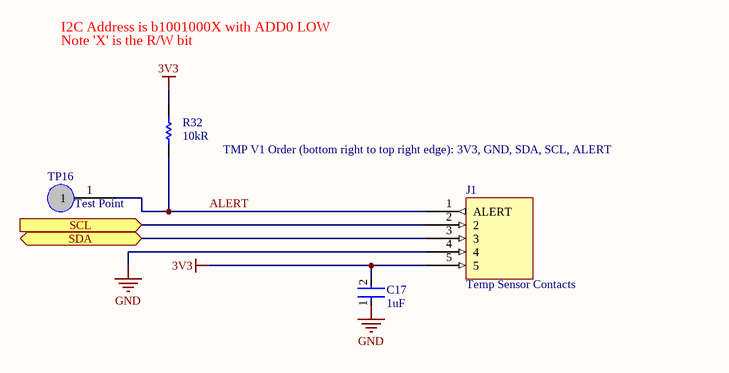
[diagram p4: Smartfin Main PCBA Temp Sensor Connection.SchDoc]

### Parts
C17  value 1uF  [FP-CC0402-IPC_C]  (hidden comment: cc0402krx5r6bb105)
J1  Temp Sensor Contacts  [Temp Sensor-Footprint-1]
R32  value 10kR  [RESC1005X04N]  (hidden comment: RC0402FR-0710KL)
TP16  Test Point  [New footprint 1]

### Ports
SCL (in), SDA (bidir)

### Nets
3V3: C17.2 J1.5 R32.2
GND: C17.1 J1.4
ALERT: J1.1(ALERT) R32.1 TP16.1
SCL: J1.2 ; port SCL
SDA: J1.3 ; port SDA

### Notes on the sheet
- I2C Address is b1001000X with ADD0 LOW
- Note 'X' is the R/W bit
- TMP V1 Order (bottom right to top right edge): 3V3, GND, SDA, SCL, ALERT

### Library data of the parts
C17 = YAGEO-CC0402KRX5R6BB105-1: as C2 on sheet Smartfin Main PCBA Control
J1 = CMP-002-000044-2: Smartfin Temperature Sensor Port
R32 = CMP-002-000053-2: as R1 on sheet Smartfin Main PCBA Control
TP16 = CMP-00002-11

## Sheet Smartfin Main PCBA USB.SchDoc
size Letter; TOCFontName: Consolas; TOCFontSize: 24; TOCFontColor: 0; TOCFontAttributes: 0; TOCMaxLinesInTable: 25; TOCVerticalOffset: 200; TOCHorizontalOffset: 500; TOCHorizontalSeparation: 800; TOCVerticalSeparation: 30; TOCHorizTableSize: 640; PageSetup: Record=PageOptions|CenterHorizontal=True|CenterVertical=True|PrintScale=0.96|XCorrection=1.00|YCorrection=1.00|PrintKind=0|BorderSize=5000000|LeftOffset=0|BottomOffset=0|Orientation=2|PaperLength=1000|PaperWidth=1000|Scale=100|PaperSource=7|PrintQuality=-4|MediaType=1|DitherType=10|PaperKind=11" x 17"|PrintScaleMode=1; SheetNumber: 6; SheetTotal: 8
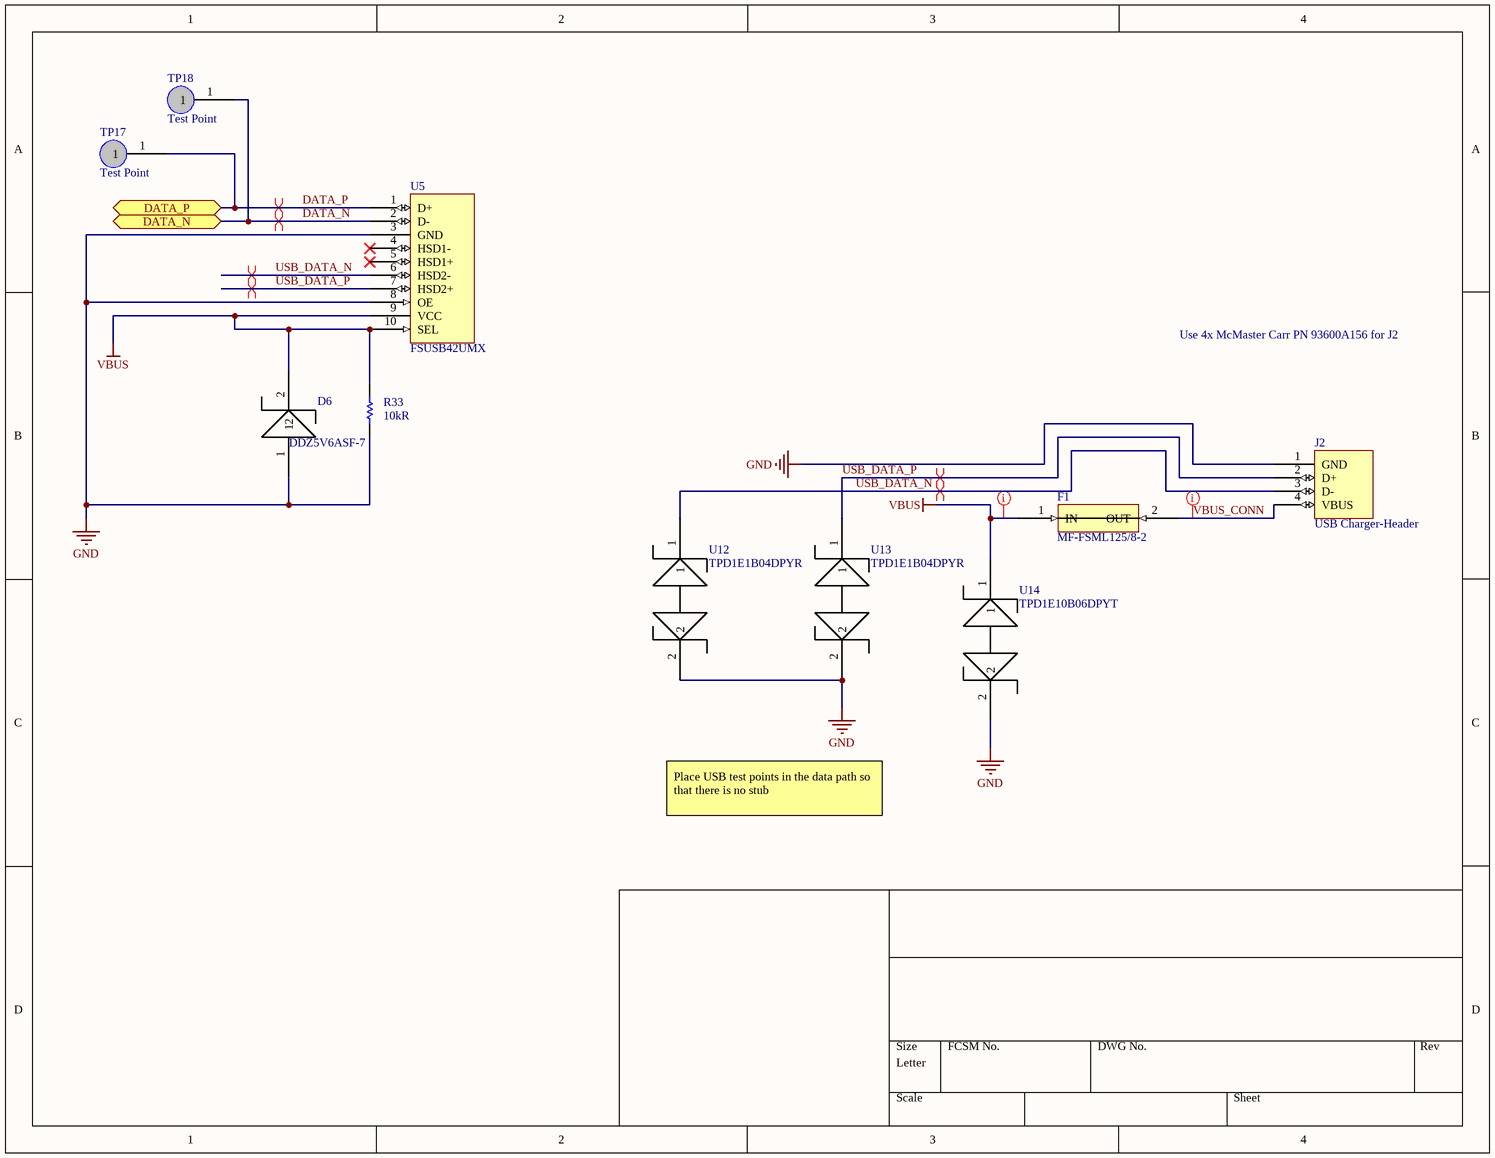
[diagram p5: Smartfin Main PCBA USB.SchDoc]

### Parts
D6  DDZ5V6ASF-7  [SODFL250X75-2N]
F1  MF-FSML125/8-2  [CAF-50P85X165-2N]
J2  USB Charger-Header  [New footprint 1]
R33  value 10kR  [RESC1005X04N]  (hidden comment: RC0402FR-0710KL)
TP17  Test Point  [New footprint 1]
TP18  Test Point  [New footprint 1]
U5  FSUSB42UMX  [IC_FSUSB42UMX]
U12  TPD1E1B04DPYR  [DIO_TPD1E05U06DPYR]
U13  TPD1E1B04DPYR  [DIO_TPD1E05U06DPYR]
U14  TPD1E10B06DPYT  [DIO_TPD1E05U06DPYR]

### Ports
DATA_N (bidir), DATA_P (bidir)

### Nets
GND: D6.1 J2.1(GND) R33.1 U5.3(GND) U5.8(OE) U12.2 U13.2 U14.2
VBUS: D6.2 F1.1(IN) R33.2 U5.9(VCC) U5.10(SEL) U14.1
DATA_N: TP18.1 U5.2(D-) ; port DATA_N
DATA_P: TP17.1 U5.1(D+) ; port DATA_P
USB_DATA_N: J2.3(D-) U5.6(HSD2-) U12.1
USB_DATA_P: J2.2(D+) U5.7(HSD2+) U13.1
VBUS_CONN: F1.2(OUT) J2.4(VBUS)

Not connected (* = marked no-connect by the designer): U5 4(HSD1-)* 5(HSD1+)*

### Layout directives
differential pair: DATA_N, DATA_P, USB_DATA_N, USB_DATA_P
differential pair; rule Signal Stimulus [Kind - Single Pulse    Level - High    Start Time = 0.000    Stop Time = 2.083n    Period Time = 4.167n]: USB_DATA_N, USB_DATA_P
rule Supply Nets [Voltage = 5.000]; net class POWER: VBUS, VBUS_CONN

### Notes on the sheet
- Use 4x McMaster Carr PN 93600A156 for J2
- Place USB test points in the data path so that there is no stub

### Library data of the parts
D6 = CMP-004-000006-2: Zener Diode, 5.42V V(Z), 2.5%, 0.5W, Silicon
F1 = CMP-002-000035-2: Pin Count: 2
J2 = CMP-002-000046-2: Smartfin USB Charger Header
R33 = CMP-002-000053-2: as R1 on sheet Smartfin Main PCBA Control
TP17 TP18 = CMP-00002-11
U5 = CMP-002-000013-3: USB Switch IC 1 Channel 10-UMLP _1.8x1.4_; MF: ON Semiconductor; Price: None; MP: FSUSB42UMX; Package: UFQFN-10 ON Semiconductor; Source: SnapEDAsch.SchLib; SnapEDA_Link: https://www.snapeda.com/parts/FSUSB42UMX/ON%20Semiconductor/view-part/1672388/?ref=snap; Availability: Unavailable; Design Item ID: FSUSB42UMX; Pin Count: 10; Value: *; Component Type: Standard
U12 U13 = CMP-004-000009-3: 1-channel ESD protection diode with low dynamic resistance and low clamping -Voltage 2-X1SON -40 to 125; MF: Texas Instruments; MP: TPD1E1B04DPYR; Mouser-Purchase-URL: https://snapeda.com/shop?store=Mouser&id=616615; Design Item ID: TPD1E1B04DPYR; Texas_Instruments-Purchase-URL: https://snapeda.com/shop?store=Texas+Instruments&id=616615; Availability: Warning; SnapEDA_Link: https://www.snapeda.com/parts/TPD1E1B04DPYR/Texas%20Instruments/view-part/616615/?ref=snap; Price: None; Component Type: Standard; Package: X1SON-2 Texas Instruments; Pin Count: 2; Value: *; Source: TPD1E1B04DPYR.SchLib
U14 = CMP-004-000000-4: Single-channel ESD in 0402 package with 10pF capacitance and 6-V breakdown 2-X1SON -40 to 125; MF: Texas Instruments; Pin Count: 2; Check_prices: https://www.snapeda.com/parts/TPD1E10B06DPYT/Texas%20Instruments/view-part/231963/?ref=eda; MP: TPD1E10B06DPYT; Design Item ID: TPD1E10B06DPYT; Component Type: Standard; Digi-Key_Part_Number: 296-41842-1-ND; SnapEDA_Link: https://www.snapeda.com/parts/TPD1E10B06DPYT/Texas%20Instruments/view-part/231963/?ref=snap; Package: X1SON-2 Texas Instruments; Purchase-URL: https://pricing.snapeda.com/search/part/TPD1E10B06DPYT/?ref=eda; Source: TPD1E10B06DPYT.SchLib; Value: *

## Sheet Smartfin Main PCBA Wet Dry Sensor.SchDoc
size Letter; TOCFontName: Consolas; TOCFontSize: 24; TOCFontColor: 0; TOCFontAttributes: 0; TOCMaxLinesInTable: 25; TOCVerticalOffset: 200; TOCHorizontalOffset: 500; TOCHorizontalSeparation: 800; TOCVerticalSeparation: 30; TOCHorizTableSize: 640; PageSetup: Record=PageOptions|CenterHorizontal=True|CenterVertical=True|PrintScale=0.96|XCorrection=1.00|YCorrection=1.00|PrintKind=0|BorderSize=5000000|LeftOffset=0|BottomOffset=0|Orientation=2|PaperLength=1000|PaperWidth=1000|Scale=100|PaperSource=7|PrintQuality=-4|MediaType=1|DitherType=10|PaperKind=11" x 17"|PrintScaleMode=1; SheetNumber: 7; SheetTotal: 8
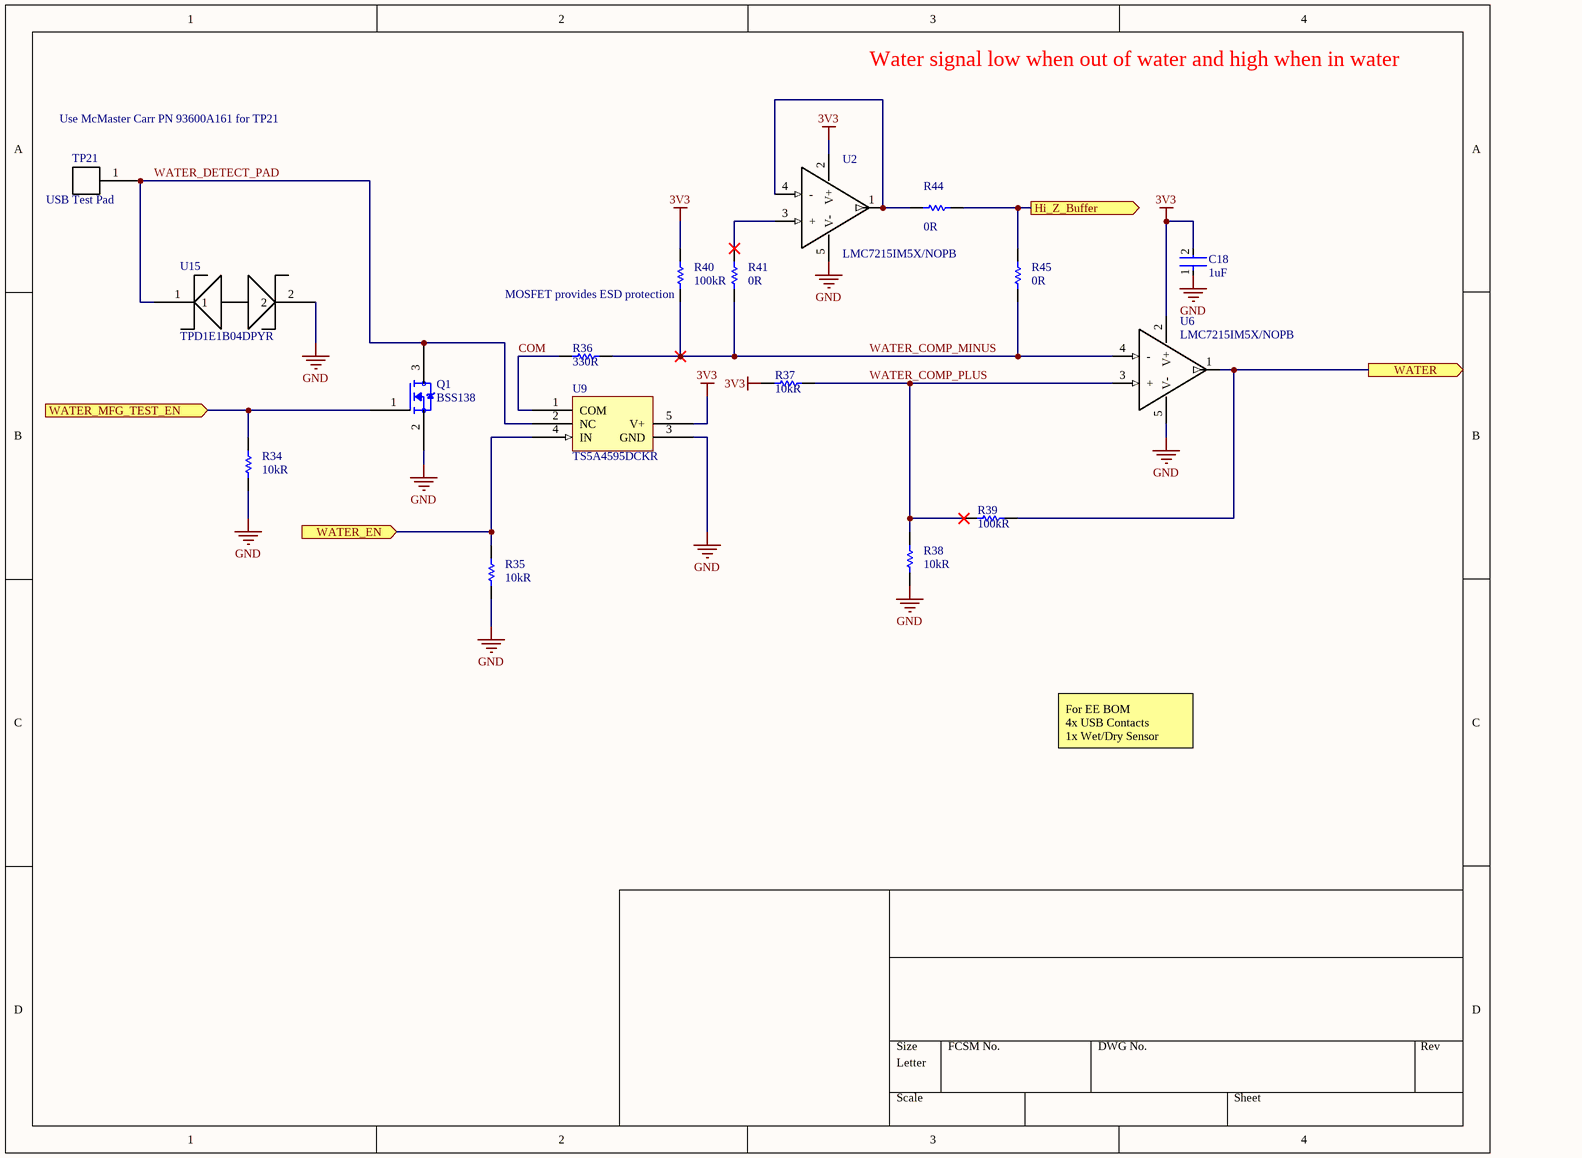
[diagram p6: Smartfin Main PCBA Wet Dry Sensor.SchDoc]

### Parts
C18  value 1uF  [FP-CC0402-IPC_C]  (hidden comment: cc0402krx5r6bb105)
Q1  BSS138  [SOT95P237X111-3N]
R34  value 10kR  [RESC1005X04N]  (hidden comment: RC0402FR-0710KL)
R35  value 10kR  [RESC1005X04N]  (hidden comment: RC0402FR-0710KL)
R36  value 330R  [RESC1005X04N]  (hidden comment: RC0402FR-07330RL)
R37  value 10kR  [RESC1005X04N]  (hidden comment: RC0402FR-0710KL)
R38  value 10kR  [RESC1005X04N]  (hidden comment: RC0402FR-0710KL)
R39  value 100kR  [RESC1005X04N]  (hidden comment: RC0402FR-07100KL)
R40  value 100kR  [RESC1005X04N]  (hidden comment: RC0402FR-07100KL)
R41  value 0R  [RESC1005X04N]  (hidden comment: RC0402JR-070RL)
R44  value 0R  [RESC1005X04N]  (hidden comment: RC0402JR-070RL)
R45  value 0R  [RESC1005X04N]  (hidden comment: RC0402JR-070RL)
TP21  USB Test Pad  [New footprint 1]
U2  LMC7215IM5X/NOPB  [SOT95P280X145-5N]
U6  LMC7215IM5X/NOPB  [SOT95P280X145-5N]
U9  TS5A4595DCKR  [SOT65P210X110-5N]
U15  TPD1E1B04DPYR  [DIO_TPD1E05U06DPYR]

### Ports
Hi_Z_Buffer (out), WATER (out), WATER_EN (in), WATER_MFG_TEST_EN (in)

### Nets
3V3: C18.2 R37.2 R40.1 U2.2(V+) U6.2(V+) U9.5(V+)
GND: C18.1 Q1.2 R34.1 R35.1 R38.2 U2.5(V-) U6.5(V-) U9.3(GND) U15.2
COM: R36.2 U9.1(COM)
Hi_Z_Buffer: R44.2 R45.2 ; port Hi_Z_Buffer
WATER: R39.1 U6.1(OUT) ; port WATER
WATER_COMP_MINUS: R36.1 R40.2 R41.1 R45.1 U6.4(-)
WATER_COMP_PLUS: R37.1 R38.1 R39.2 U6.3(+)
WATER_DETECT_PAD: Q1.3 TP21.1 U9.2(NC) U15.1
WATER_EN: R35.2 U9.4(IN) ; port WATER_EN
WATER_MFG_TEST_EN: Q1.1 R34.2 ; port WATER_MFG_TEST_EN
NetR41_2: R41.2 U2.3(+)
NetR44_1: R44.1 U2.1(OUT) U2.4(-)

### Notes on the sheet
- Water signal low when out of water and high when in water
- Use McMaster Carr PN 93600A161 for TP21
- (near R40) MOSFET provides ESD protection
- For EE BOM
  4x USB Contacts
  1x Wet/Dry Sensor Contact

### Library data of the parts
C18 = YAGEO-CC0402KRX5R6BB105-1: as C2 on sheet Smartfin Main PCBA Control
Q1 = CMP-002-000027-5: N-Channel 50V 220mA (Ta) 360mW (Ta) Surface Mount SOT-23-3; MF: ON Semiconductor; Pin Count: 3; SnapEDA_Link: https://www.snapeda.com/parts/BSS138/ON%20Semiconductor/view-part/4794929/?ref=snap; Source: BSS138.SchLib; Availability: Good; Design Item ID: BSS138; Price: None; Package: SOT-23 ON Semiconductor; Component Type: Standard; MP: BSS138; Purchase-URL: https://pricing.snapeda.com/search/part/BSS138/?ref=eda; Value: *; Reach SVHC Compliant: Yes; Check_prices: https://www.snapeda.com/parts/BSS138/ON%20Semiconductor/view-part/4794929/?ref=eda; RoHS Compliant: Yes
R34 R35 R37 R38 = CMP-002-000053-2: as R1 on sheet Smartfin Main PCBA Control
R36 = YAGEO-RC0402FR-07330RL-1: Fixed Resistor, Metal Glaze/thick Film, 0.0625W, 330ohm, 50V, 1% +/-Tol, 100ppm/Cel, Surface Mount, 0402
R39 R40 = YAGEO-RC0402FR-07100KL-1: Fixed Resistor, Metal Glaze/thick Film, 0.0625W, 100000ohm, 50V, 1% +/-Tol, 100ppm/Cel, Surface Mount, 0402
R41 R44 R45 = YAGEO-RC0402JR-070RL-1: as R2 on sheet Smartfin Main PCBA Control
TP21 = CMP-002-000049-1
U2 U6 = CMP-002-000012-5: Low power, low voltage comparator with push-pull output; MF: Texas Instruments; Design Item ID: LMC7215IM5X/NOPB; MP: LMC7215IM5X/NOPB; Component Type: Standard; Availability: In Stock; Price: None; Package: SOT-23-5 Texas Instruments; Source: LMC7215IM5X_NOPB.SchLib; Check_prices: https://www.snapeda.com/parts/LMC7215IM5X/NOPB/Texas+Instruments/view-part/?ref=eda; Pin Count: 5; Purchase-URL: https://pricing.snapeda.com/search?q=LMC7215IM5X/NOPB&ref=eda; SnapEDA_Link: https://www.snapeda.com/parts/LMC7215IM5X/NOPB/Texas+Instruments/view-part/?ref=snap; Value: *
U9 = CMP-002-000032-5: Package: SOT23; Component Type: Switch; Pin Count: 5
U15 = CMP-004-000009-3: as U12 on sheet Smartfin Main PCBA USB; MP: TPD1E1B04DPYR; Mouser-Purchase-URL: https://snapeda.com/shop?store=Mouser&id=616615; Design Item ID: TPD1E1B04DPYR; Texas_Instruments-Purchase-URL: https://snapeda.com/shop?store=Texas+Instruments&id=616615; Availability: Warning; SnapEDA_Link: https://www.snapeda.com/parts/TPD1E1B04DPYR/Texas%20Instruments/view-part/616615/?ref=snap; Price: None; Component Type: Standard; Package: X1SON-2 Texas Instruments; Pin Count: 2; Value: *; Source: TPD1E1B04DPYR.SchLib

## Sheet Smartfin Main PCBA_Block Diagram.SchDoc
size Letter; PageSetup: Record=PageOptions|CenterHorizontal=True|CenterVertical=True|PrintScale=0.96|XCorrection=1.00|YCorrection=1.00|PrintKind=0|BorderSize=5000000|LeftOffset=0|BottomOffset=0|Orientation=2|PaperLength=1000|PaperWidth=1000|Scale=100|PaperSource=7|PrintQuality=-4|MediaType=1|DitherType=10|PaperKind=11" x 17"|PrintScaleMode=1
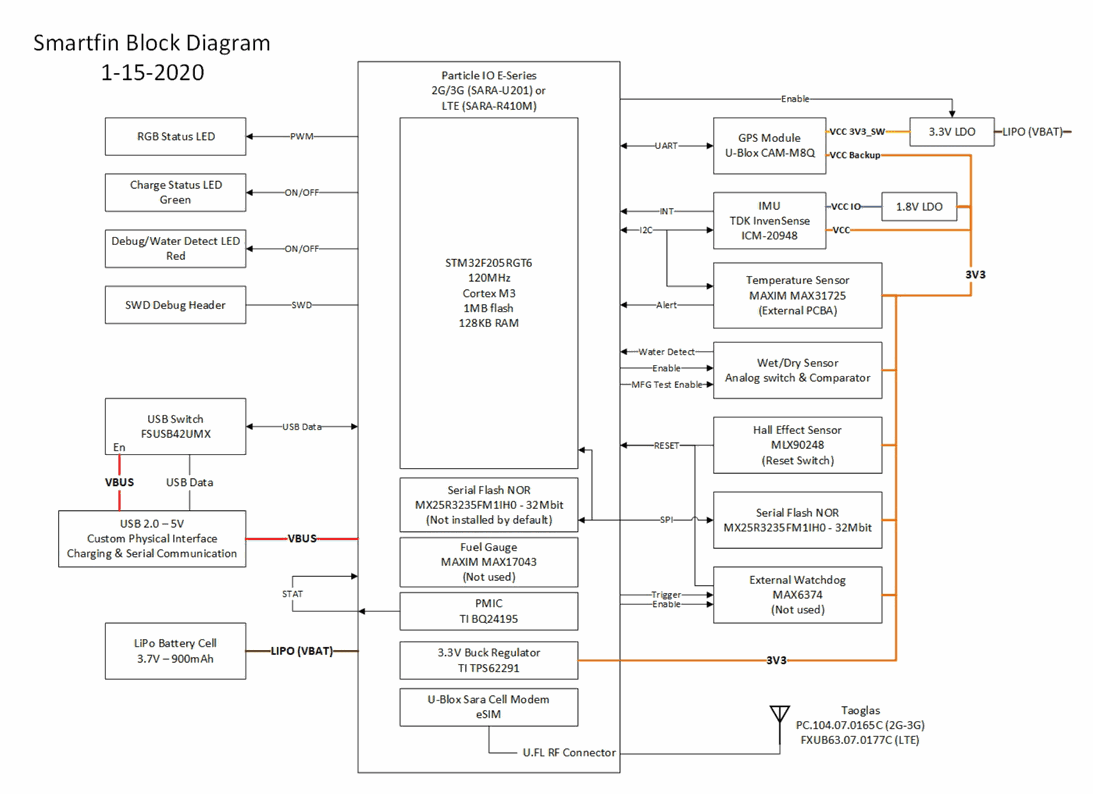
[diagram p7: Smartfin Main PCBA_Block Diagram.SchDoc]

## Nets that join several sheets
3V3: Smartfin Main PCBA Control (17 pins), Smartfin Main PCBA Motion (8 pins), Smartfin Main PCBA Temp Sensor Connection (C17.2 J1.5 R32.2), Smartfin Main PCBA Wet Dry Sensor (6 pins)
GND: Smartfin Main PCBA Control (38 pins), Smartfin Main PCBA Motion (13 pins), Smartfin Main PCBA Temp Sensor Connection (C17.1 J1.4), Smartfin Main PCBA USB (8 pins), Smartfin Main PCBA Wet Dry Sensor (9 pins)
VBUS: Smartfin Main PCBA Control (5 pins), Smartfin Main PCBA USB (6 pins)
DATA_N: Smartfin Main PCBA Control (U1.68), Smartfin Main PCBA USB (TP18.1 U5.2)
DATA_P: Smartfin Main PCBA Control (U1.69), Smartfin Main PCBA USB (TP17.1 U5.1)
Hi_Z_Buffer: Smartfin Main PCBA Control (C9.2 R15.2), Smartfin Main PCBA Wet Dry Sensor (R44.2 R45.2)
SCL: Smartfin Main PCBA Control (U1.56), Smartfin Main PCBA Motion (R22.1 R24.1), Smartfin Main PCBA Temp Sensor Connection (J1.2)
SDA: Smartfin Main PCBA Control (U1.55), Smartfin Main PCBA Motion (R21.1 R25.1), Smartfin Main PCBA Temp Sensor Connection (J1.3)
WATER: Smartfin Main PCBA Control (D3.1 TP24.1 U1.39), Smartfin Main PCBA Wet Dry Sensor (R39.1 U6.1)
WATER_EN: Smartfin Main PCBA Control (U1.57), Smartfin Main PCBA Wet Dry Sensor (R35.2 U9.4)
WATER_MFG_TEST_EN: Smartfin Main PCBA Control (U1.58), Smartfin Main PCBA Wet Dry Sensor (Q1.1 R34.2)

## Assembly variants
Smartfin Main PCBA - 2G/3G: not fitted D5 J3 R13 R32 R34 R35 R36 R37 R39 R46
Smartfin Main PCBA - LTE: not fitted D5 J3 R13 R32 R34 R35 R36 R37 R39 R46
Variant of Smartfin TSoM: not fitted D5 J3 R46